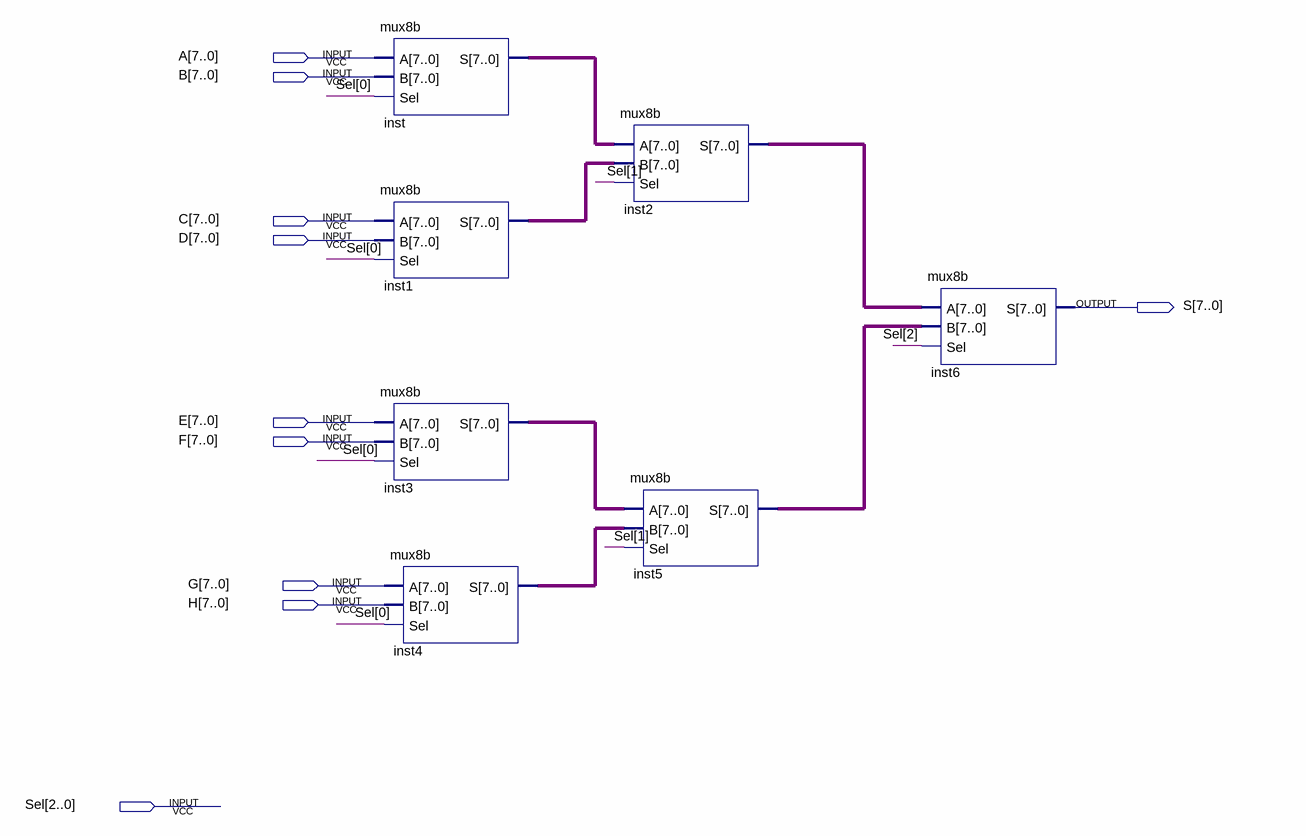
[diagram p0: schematic sheet]
// Quartus schematic mux8b8.bdf as structural Verilog: 7 symbols, 10 pins
module mux8b8 (
  input  [7:0] A,
  input  [7:0] B,
  input  [7:0] C,
  input  [7:0] D,
  input  [7:0] E,
  input  [7:0] F,
  input  [7:0] G,
  input  [7:0] H,
  input  [2:0] Sel,
  output [7:0] S
);

  wire [7:0] inst1_s, inst2_s, inst3_s, inst4_s, inst5_s, inst_s;

  mux8b inst (.A(A), .B(B), .Sel(Sel[0]), .S(inst_s));
  mux8b inst1 (.A(C), .B(D), .Sel(Sel[0]), .S(inst1_s));
  mux8b inst3 (.A(E), .B(F), .Sel(Sel[0]), .S(inst3_s));
  mux8b inst4 (.A(G), .B(H), .Sel(Sel[0]), .S(inst4_s));
  mux8b inst2 (.A(inst_s), .B(inst1_s), .Sel(Sel[1]), .S(inst2_s));
  mux8b inst5 (.A(inst3_s), .B(inst4_s), .Sel(Sel[1]), .S(inst5_s));
  mux8b inst6 (.A(inst2_s), .B(inst5_s), .Sel(Sel[2]), .S(S));
endmodule
